# EAGLE design macbook-smc-debug-breakout (EAGLE 9.5.0)
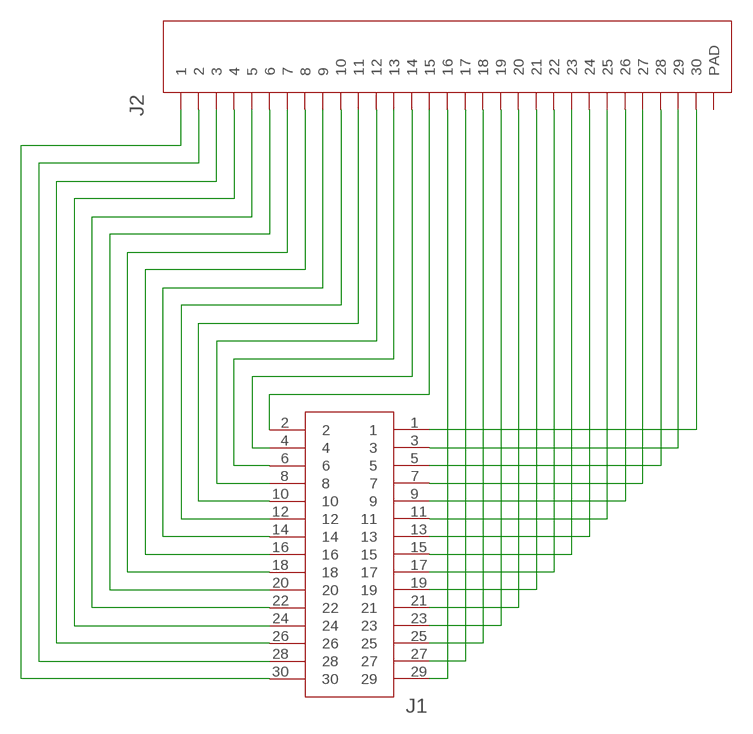
[diagram p0: schematic, sheet 1]

## Parts
J1  DF40HC(3.0)-30DS-0.4V(51)  [CONN_30DS-0.4V(51)]
J2  3-1734592-0  [TE_3-1734592-0]

## Nets
N$1: J1.1 J2.30
N$2: J1.3 J2.29
N$3: J1.5 J2.28
N$4: J1.7 J2.27
N$5: J1.9 J2.26
N$6: J1.11 J2.25
N$7: J1.13 J2.24
N$8: J1.15 J2.23
N$9: J1.17 J2.22
N$10: J1.19 J2.21
N$11: J1.21 J2.20
N$12: J1.23 J2.19
N$13: J1.25 J2.18
N$14: J1.27 J2.17
N$15: J1.29 J2.16
N$16: J1.2 J2.15
N$17: J1.4 J2.14
N$18: J1.6 J2.13
N$19: J1.8 J2.12
N$20: J1.10 J2.11
N$21: J1.12 J2.10
N$22: J1.14 J2.9
N$23: J1.16 J2.8
N$24: J1.18 J2.7
N$25: J1.20 J2.6
N$26: J1.22 J2.5
N$27: J1.24 J2.4
N$28: J1.26 J2.3
N$29: J1.28 J2.2
N$30: J1.30 J2.1
Unconnected: J2.S1(PAD) J2.S2(PAD)

## Library data of the parts
J1 = DF40HC(3.0)-30DS-0.4V:DF40HC(3.0)-30DS-0.4V(51); BUILT_BY: EMA_Matt; COPYRIGHT: Copyright (C) 2018 Accelerated Designs. All rights reserved; MANUFACTURER_PART_NUMBER: DF40HC(3.0)-30DS-0.4V(51); SOURCELIBRARY: Hirose_12_20_2019; VENDOR: Hirose
J2 = J-TEConnectivity-X-1734592-X:3-1734592-0

## Board
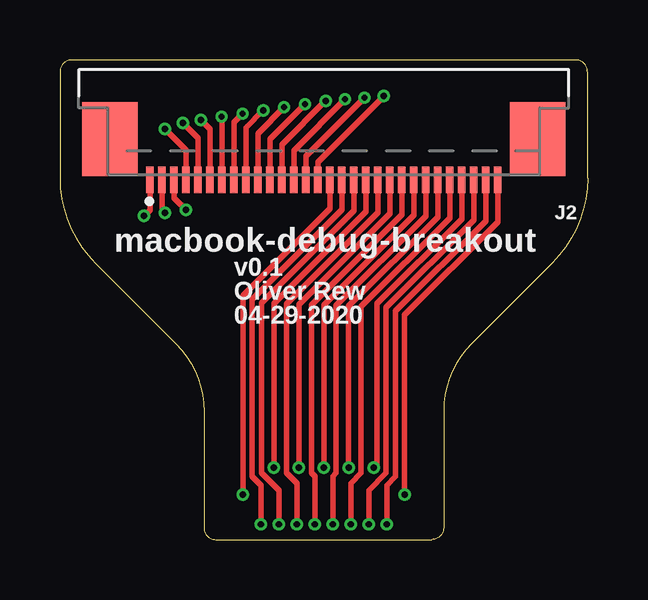
[diagram p1: board, top side]
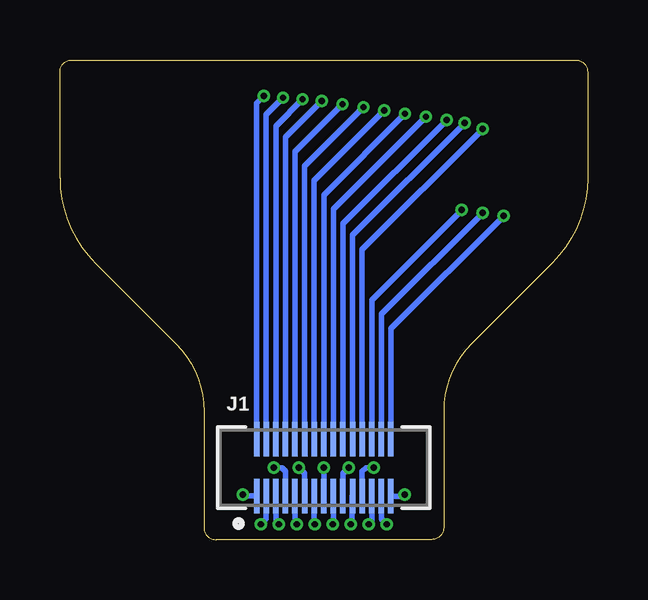
[diagram p2: board, bottom side, seen from below]

Size 22 x 20 mm. Coordinates in mm from the lower left corner, seen from the top.
Outline: 16,5.34 16,0.5 arc-90 15.5,0 6.5,0 arc-90 6,0.5 6,5.34 arc45 4.83,8.17 1.46,11.54 arc-45 0,15.07 0,19.5 arc-90 0.5,20 21.5,20 arc-90 22,19.5 22,15.07 arc-45 20.54,11.54 17.17,8.17 arc45 16,5.34
Copper layers (1*16): Top 0.035559375mm / dielectric 1.6mm / Bottom 0.035559375mm
Design rules "oshpark-2layer *": minimum track width 6mil, minimum drill 10mil, track to track 6mil, track to pad 6mil, pad to pad 6mil, via to via 6mil, smd to smd 6mil, copper to edge 15mil, drill to drill 6mil, minimum pad ring 5mil, minimum via ring 5mil, stop-mask expansion 2.5mil, vias tented up to drill 12mil, thermal gap 10mil

### Footprints (pad centres in the part's own frame; a part is rotated, then mirrored left to right if it is on the bottom)
CONN_30DS-0.4V(51) = smd 0.229 x 1.448: 1 -2.8,-1.185; 2 -2.8,1.192; 3 -2.4,-1.185; 4 -2.4,1.192; 5 -2,-1.185; 6 -2,1.192; 7 -1.6,-1.185; 8 -1.6,1.192; 9 -1.2,-1.185; 10 -1.2,1.192; 11 -0.8,-1.185; 12 -0.8,1.192; 13 -0.4,-1.185; 14 -0.4,1.192; 15 0,-1.185; 16 0,1.188; 17 0.4,-1.188; 18 0.4,1.188; 19 0.8,-1.188; 20 0.8,1.188; 21 1.2,-1.188; 22 1.2,1.188; 23 1.6,-1.188; 24 1.6,1.188; 25 2,-1.188; 26 2,1.188; 27 2.4,-1.188; 28 2.4,1.188; 29 2.8,-1.188; 30 2.8,1.188
TE_3-1734592-0 = smd 0.3 x 1.1: 1 -7.25,0; 2 -6.75,0; 3 -6.25,0; 4 -5.75,0; 5 -5.25,0; 6 -4.75,0; 7 -4.25,0; 8 -3.75,0; 9 -3.25,0; 10 -2.75,0; 11 -2.25,0; 12 -1.75,0; 13 -1.25,0; 14 -0.75,0; 15 -0.25,0; 16 0.25,0; 17 0.75,0; 18 1.25,0; 19 1.75,0; 20 2.25,0; 21 2.75,0; 22 3.25,0; 23 3.75,0; 24 4.25,0; 25 4.75,0; 26 5.25,0; 27 5.75,0; 28 6.25,0; 29 6.75,0; 30 7.25,0 | smd 2.3 x 3.1: S1 8.92,1.7; S2 -8.92,1.7

### Placement (x,y rotation side)
J1  11,3 0 bottom
J2  11,15 0 top

### Tracks (layer width: path | path; a pad name or v marks a point on that pad's centre or on a via)
N$1  (via drill 0.25)
  Top 0.229: v14.38,1.88 14.37,1.89 14.37,9.37 18.25,13.25 J2.30
  Bottom 0.229: J1.1 14.31,1.81 v14.38,1.88
N$2  (via drill 0.25)
  Top 0.229: v13.62,0.64 13.62,2.27 13.98,2.63 13.98,9.52 17.75,13.29 J2.29
  Bottom 0.229: J1.3 13.4,0.86 v13.62,0.64
N$3  (via drill 0.25)
  Top 0.229: v12.88,0.64 12.88,2.06 13.6,2.78 13.6,9.68 17.25,13.33 J2.28
  Bottom 0.229: J1.5 13,0.76 v12.88,0.64
N$4  (via drill 0.25)
  Top 0.229: v13.08,3 13.22,3.14 13.22,9.84 16.75,13.37 J2.27
  Bottom 0.229: J1.7 12.6,2.85 12.75,3 v13.08,3
N$5  (via drill 0.25)
  Top 0.229: v12.12,0.64 12.12,2.35 12.56,2.78 12.56,9.72 16.25,13.4 J2.26
  Bottom 0.229: J1.9 12.2,0.71 v12.12,0.64
N$6  (via drill 0.25)
  Top 0.229: J2.25 15.75,13.44 12.04,9.73 v12.04,3
  Bottom 0.229: J1.11 11.8,2.76 v12.04,3
N$7  (via drill 0.25)
  Top 0.229: v11.38,0.64 11.38,2.64 11.52,2.78 11.52,9.75 15.25,13.48 J2.24
  Bottom 0.229: J1.13 11.4,0.66 v11.38,0.64
N$8  (via drill 0.25)
  Top 0.229: J2.23 14.75,13.52 11,9.77 v11,3
  Bottom 0.229: J1.15 v11,3
N$9  (via drill 0.25)
  Top 0.229: v10.62,0.64 10.62,2.64 10.48,2.78 10.48,9.79 14.25,13.56 J2.22
  Bottom 0.229: J1.17 10.6,0.66 v10.62,0.64
N$10  (via drill 0.25)
  Top 0.229: J2.21 13.75,13.6 9.96,9.81 v9.96,3
  Bottom 0.229: J1.19 10.2,2.76 v9.96,3
N$11  (via drill 0.25)
  Top 0.229: v9.88,0.64 9.88,2.35 9.44,2.78 9.44,9.83 13.25,13.64 J2.20
  Bottom 0.229: J1.21 9.82,1.79 9.82,0.64 v9.88,0.64
N$12  (via drill 0.25)
  Top 0.229: J2.19 12.75,13.68 8.92,9.84 v8.92,3
  Bottom 0.229: J1.23 9.4,2.85 9.25,3 v8.92,3
N$13  (via drill 0.25)
  Top 0.229: v9.12,0.64 9.12,2.06 8.4,2.78 8.4,9.86 12.25,13.72 J2.18
  Bottom 0.229: J1.25 9,0.76 v9.12,0.64
N$14  (via drill 0.25)
  Top 0.229: v8.38,0.64 8.38,2.27 8.02,2.63 8.02,10.02 11.75,13.76 J2.17
  Bottom 0.229: J1.27 8.6,0.86 v8.38,0.64
N$15  (via drill 0.25)
  Top 0.229: v7.62,1.88 7.63,1.89 7.63,10.18 11.25,13.79 J2.16
  Bottom 0.229: J1.29 7.69,1.81 v7.62,1.88
N$16  (via drill 0.25)
  Top 0.229: J2.15 10.75,15.75 v13.5,18.5
  Bottom 0.229: J1.2 13.8,18.2 v13.5,18.5
N$17  (via drill 0.25)
  Top 0.229: J2.14 10.25,15.99 v12.69,18.43
  Bottom 0.229: v12.69,18.43 13.4,17.73 J1.4
N$18  (via drill 0.25)
  Top 0.229: J2.13 9.75,16.22 v11.89,18.36
  Bottom 0.229: v11.89,18.36 13,17.25 J1.6
N$19  (via drill 0.25)
  Top 0.229: J2.12 9.25,16.46 v11.08,18.29
  Bottom 0.229: v11.08,18.29 12.6,16.77 J1.8
N$20  (via drill 0.25)
  Top 0.229: J2.11 8.75,16.7 v10.21,18.16
  Bottom 0.229: J1.10 12.2,16.18 v10.21,18.16
N$21  (via drill 0.25)
  Top 0.229: J2.10 8.25,16.93 v9.35,18.03
  Bottom 0.229: J1.12 11.8,15.57 v9.35,18.03
N$22  (via drill 0.25)
  Top 0.229: J2.9 7.75,17.17 v8.48,17.9
  Bottom 0.229: J1.14 11.4,14.97 v8.48,17.9
N$23  (via drill 0.25)
  Top 0.229: J2.8 7.25,17.41 v7.61,17.77
  Bottom 0.229: J1.16 11,14.38 v7.61,17.77
N$24  (via drill 0.25)
  Top 0.229: J2.7 v6.75,17.62 v6.74,17.63
  Bottom 0.229: J1.18 10.6,13.78 v6.74,17.63
N$25  (via drill 0.25)
  Top 0.229: J2.6 6.25,17.12 v5.88,17.5
  Bottom 0.229: J1.20 10.2,13.18 v5.88,17.5
N$26  (via drill 0.25)
  Top 0.229: J2.5 5.75,16.75 v5.12,17.38
  Bottom 0.229: J1.22 9.8,12.7 v5.12,17.38
N$27  (via drill 0.25)
  Top 0.229: J2.4 5.25,16.25 v4.38,17.12
  Bottom 0.229: J1.24 9.4,12.1 v4.38,17.12
N$28  (via drill 0.25)
  Top 0.229: J2.3 4.75,14.25 v5.25,13.75
  Bottom 0.229: v5.25,13.75 9,10 J1.26
N$29  (via drill 0.25)
  Top 0.229: J2.2 4.25,13.75 v4.38,13.62
  Bottom 0.229: J1.28 8.6,9.4 v4.38,13.62
N$30  (via drill 0.25)
  Top 0.229: J2.1 3.75,13.75 v3.5,13.5
  Bottom 0.229: v3.5,13.5 8.2,8.8 J1.30

### Text on the board
tPlace: macbook-debug-breakout | v0.1 | Oliver Rew | 04-29-2020